# EAGLE schematic atmega_fusebit_doctor_V2_Custom_7_usb (EAGLE 7.6.0)
AUTHOR: PAWEL KISIELEWSKI (MANEKINEN); REV: 2.0
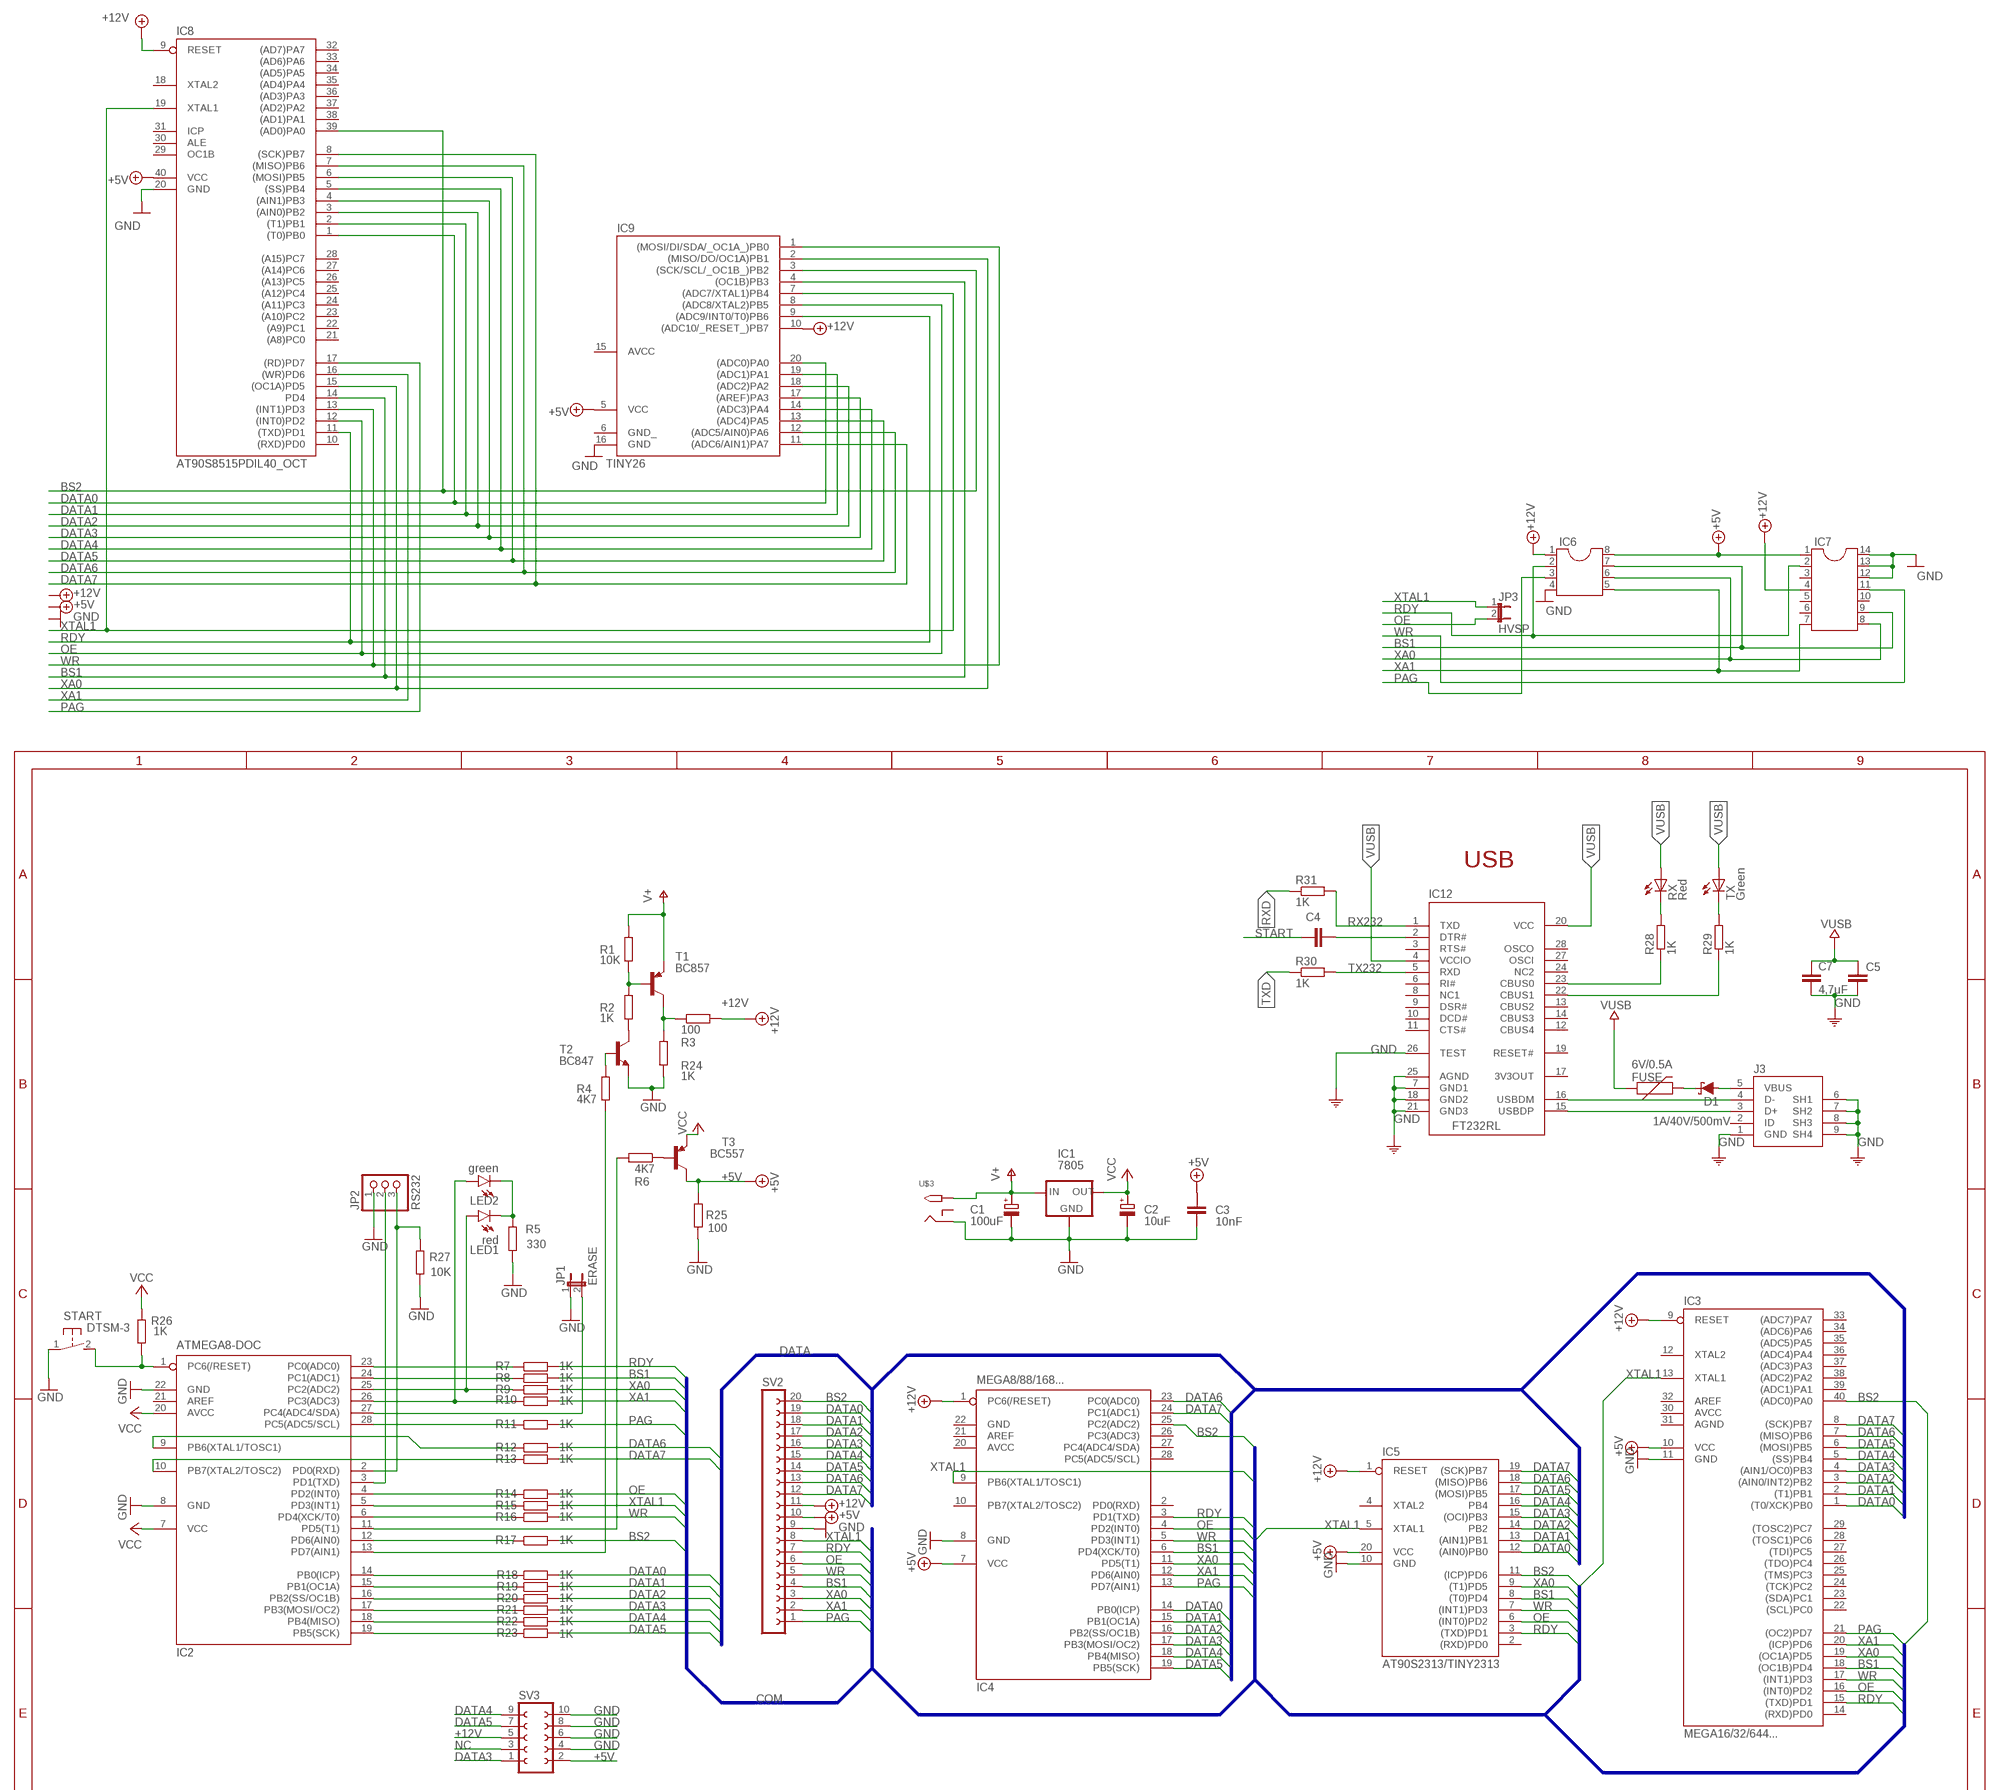
[diagram p0: schematic, sheet 1, part 1 of 3]
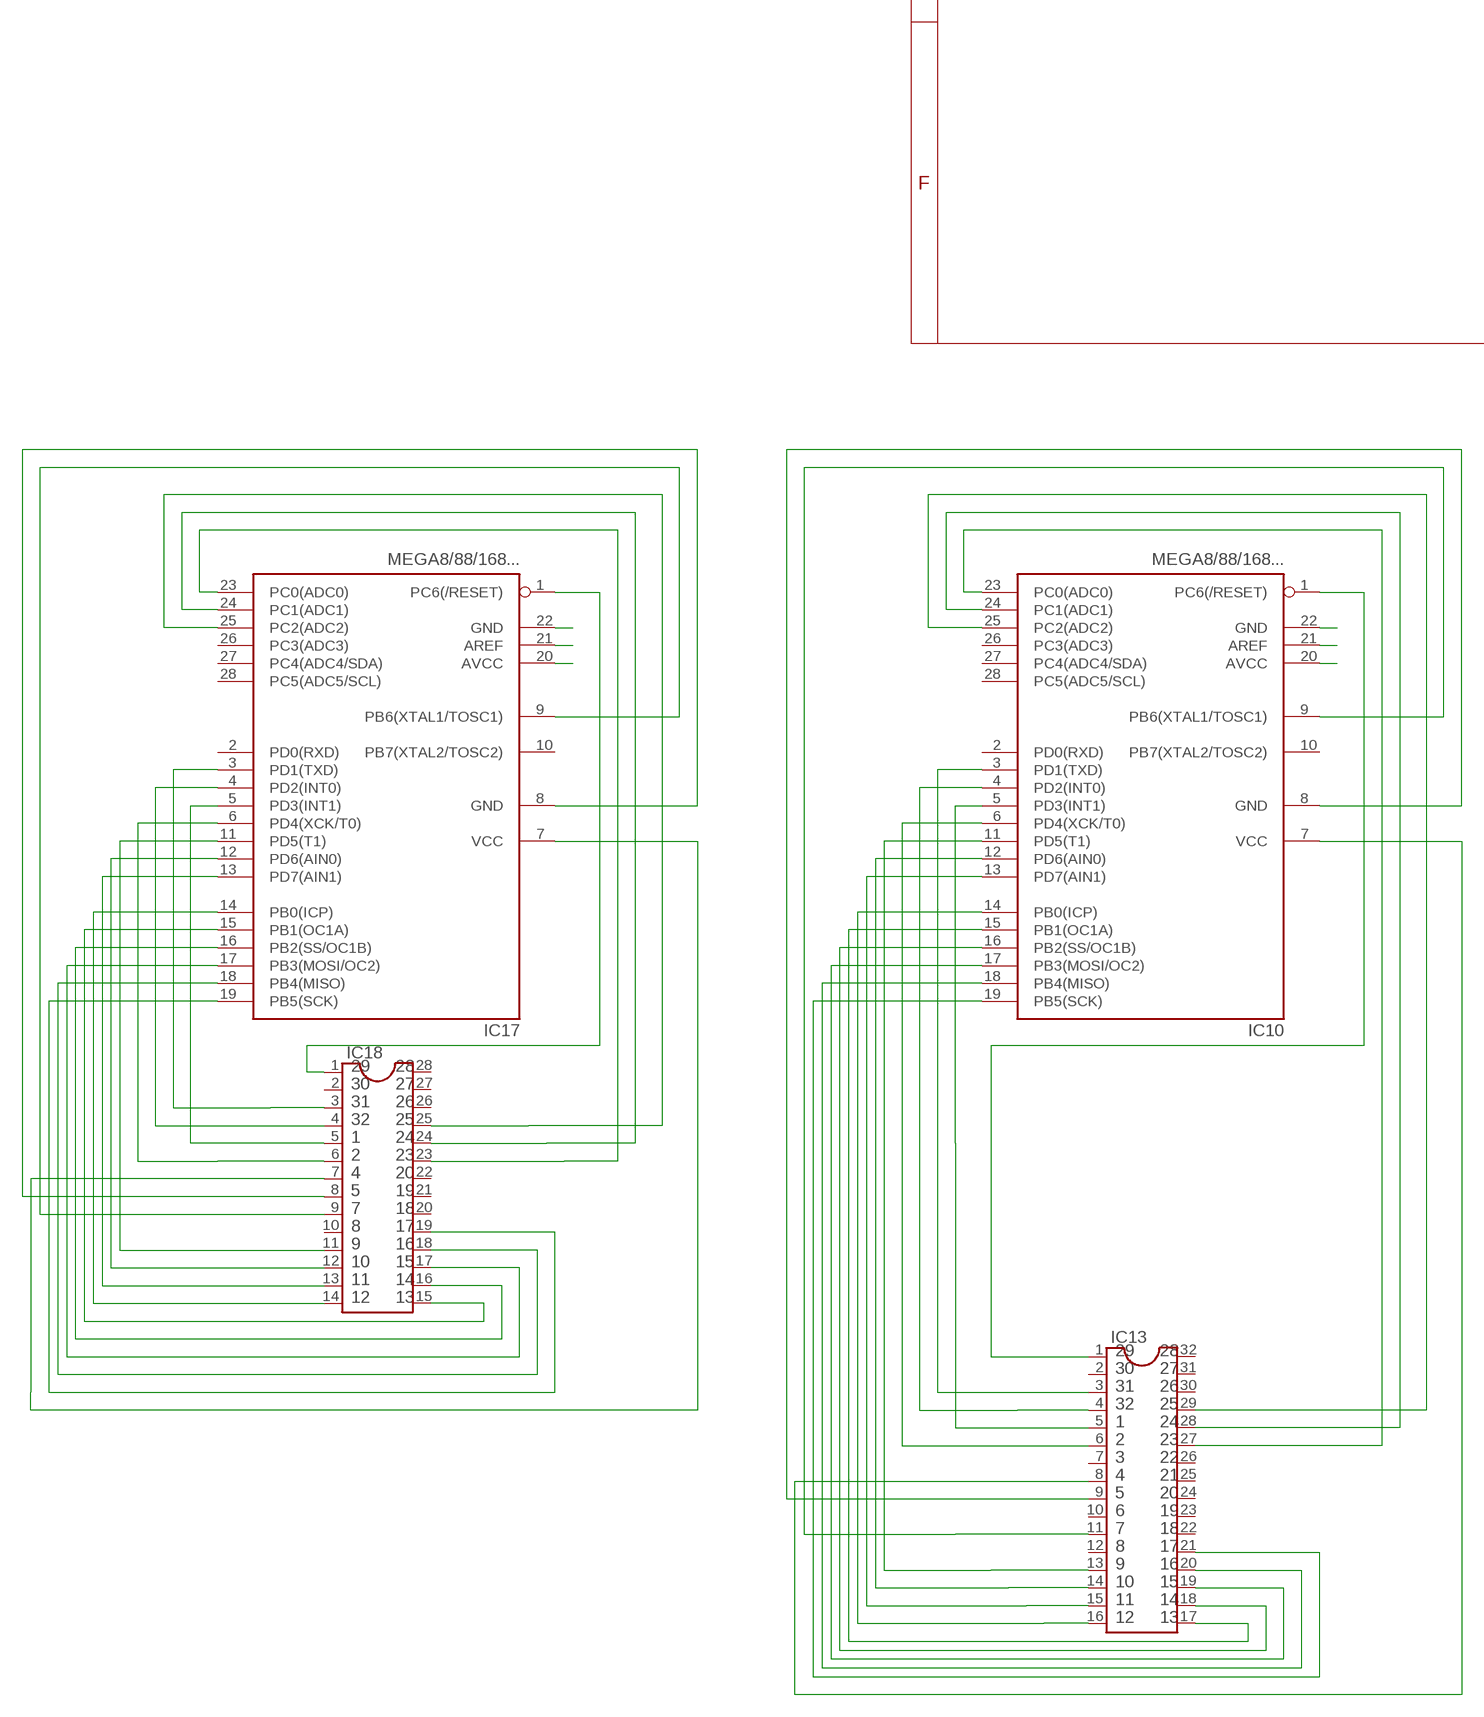
[diagram p1: schematic, sheet 1, part 2 of 3]
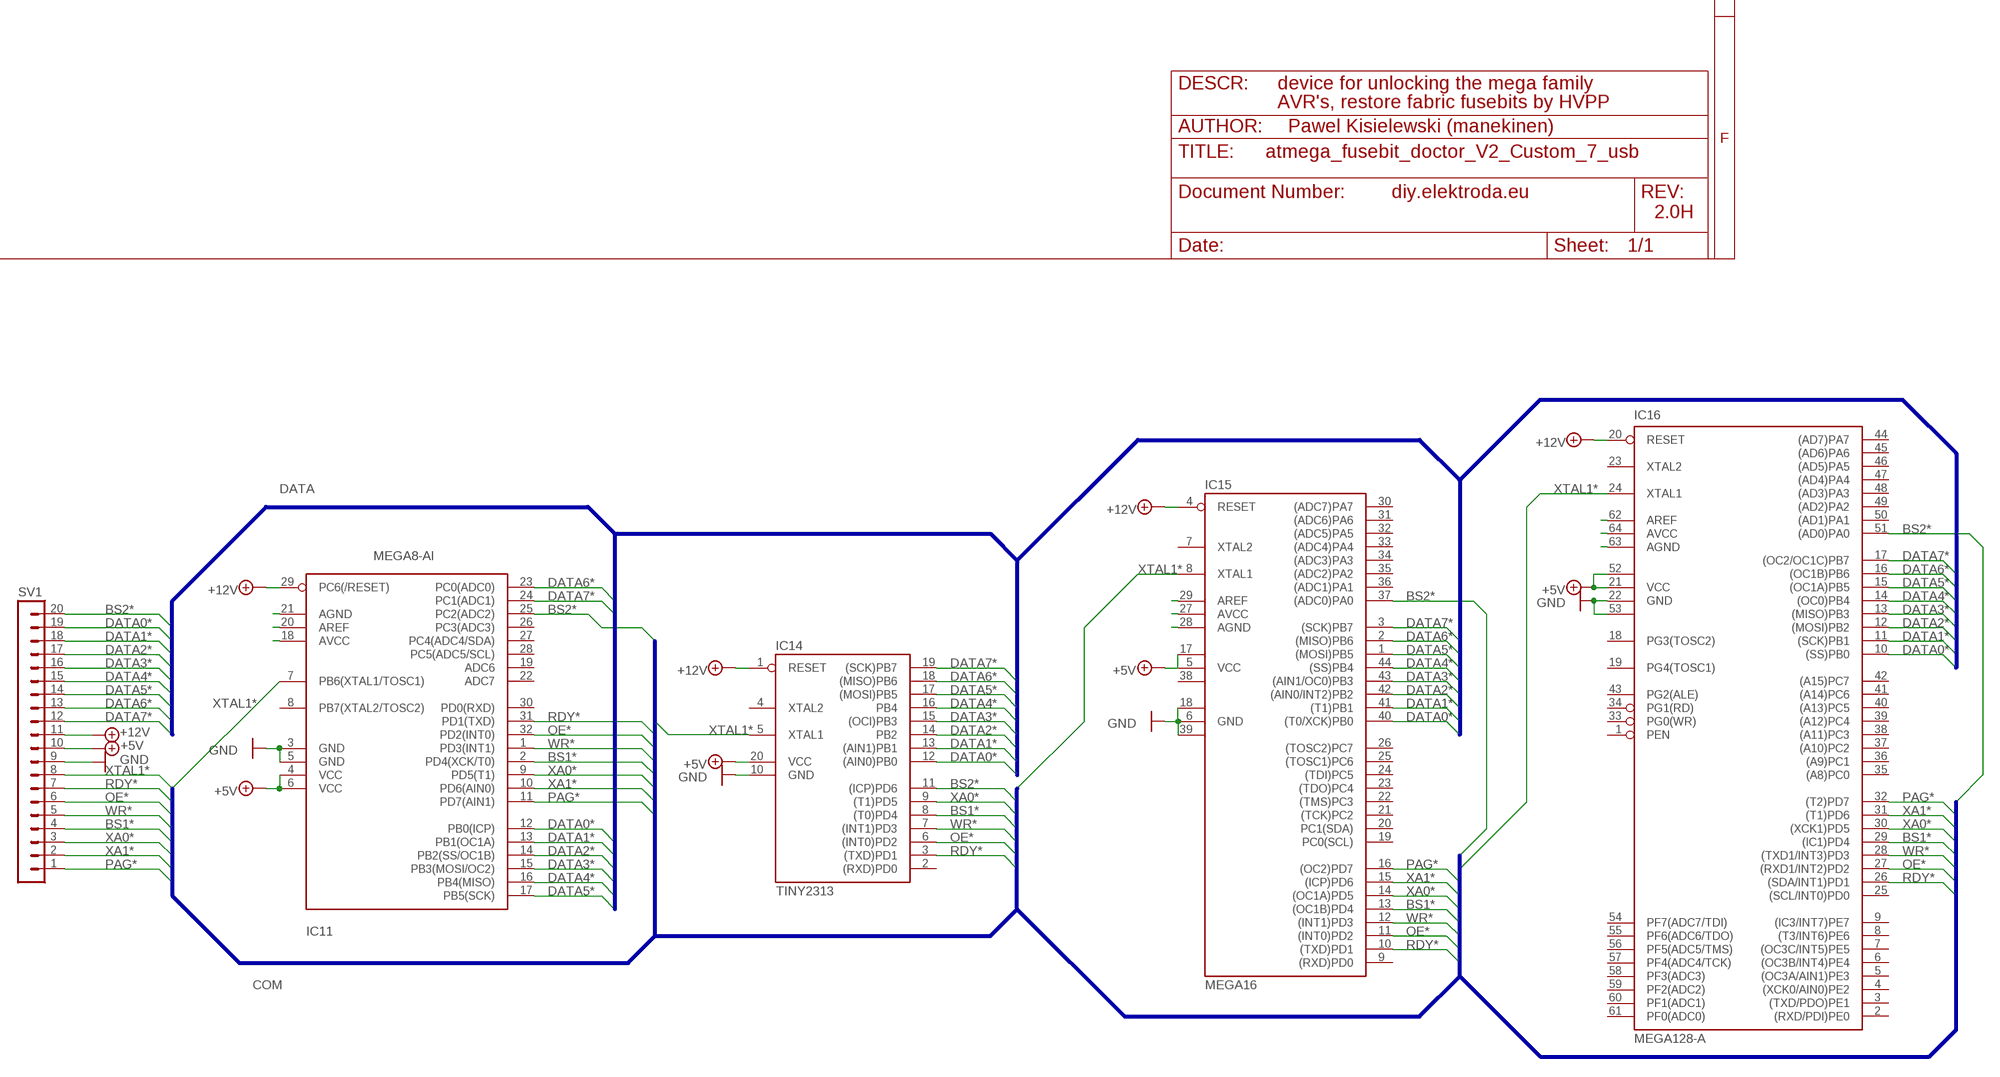
[diagram p2: schematic, sheet 1, part 3 of 3]

## Parts
C1  100uF  CPOL-EU153CLV-0605  [153CLV-0605]
C2  10uF  CPOL-EU153CLV-0405  [153CLV-0405]
C3  10nF  C-EUC0805  [C0805]
C4  100nF  C-EUC0805  [C0805]
C5  100nF  C-EUC0805  [C0805]
C7  4,7uF  C-EUC1206  [C1206]
D1  1A/40V/500mV  DIODE-SCHOTTKY-SS14  [SMA-DIODE]
FUSE  6V/0.5A  PPTC_HALF-AMP  [1206]
IC1  7805  78XXL  [78XXL]
IC2  ATMEGA8-DOC  MEGA8-P  [DIL28-3_OCT]
IC3  MEGA16/32/644...  MEGA16-P  [DIL40_OCT]
IC4  MEGA8/88/168...  MEGA8-P  [DIL28-3_OCT]
IC5  AT90S2313/TINY2313  AT90S2313P  [DIL20_OCT]
IC6  DIL8S  [SOCKED-08]
IC7  DIL14S  [SOCKED-14]
IC8  AT90S8515PDIL40_OCT  [DIL40_OCT]
IC9  TINY26  [DIL20_OCT]
IC10  MEGA8/88/168...  MEGA8-P  [DIL28-3_OCT]
IC11  MEGA8-AI  [TQFP32-08]
IC12  FT232RL  0226_FT232RL  [SSOP28]
IC13  DIL32  [DIL32]
IC14  TINY2313  AT90S2313S  [SO20L]
IC15  MEGA16  MEGA16-A  [TQFP44]
IC16  MEGA128-A  [TQFP64]
IC17  MEGA8/88/168...  MEGA8-P  [DIL28-3_OCT]
IC18  DIL28  [DIL28-6]
J3  0219_14850  [USB-MINI-B_2]
JP1  ERASE  JP1E  [JP1]
JP2  RS232  PINHD-1X3  [1X03]
JP3  HVSP  JP1E  [JP1]
LED1  red  LED1206  [LED-1206]
LED2  green  LED1206  [LED-1206]
R1  10K  R-EU_R0805  [R0805]
R2  1K  R-EU_R0805  [R0805]
R3  100  R-EU_R0805  [R0805]
R4  4K7  R-EU_R0805  [R0805]
R5  330  R-EU_R0805  [R0805]
R6  4K7  R-EU_R0805  [R0805]
R7  1K  R-EU_R0805  [R0805]
R8  1K  R-EU_R0805  [R0805]
R9  1K  R-EU_R0805  [R0805]
R10  1K  R-EU_R0805  [R0805]
R11  1K  R-EU_R0805  [R0805]
R12  1K  R-EU_R0805  [R0805]
R13  1K  R-EU_R0805  [R0805]
R14  1K  R-EU_R0805  [R0805]
R15  1K  R-EU_R0805  [R0805]
R16  1K  R-EU_R0805  [R0805]
R17  1K  R-EU_R0805  [R0805]
R18  1K  R-EU_R0805  [R0805]
R19  1K  R-EU_R0805  [R0805]
R20  1K  R-EU_R0805  [R0805]
R21  1K  R-EU_R0805  [R0805]
R22  1K  R-EU_R0805  [R0805]
R23  1K  R-EU_R0805  [R0805]
R24  1K  R-EU_R0805  [R0805]
R25  100  R-EU_R0805  [R0805]
R26  1K  R-EU_R0805  [R0805]
R27  10K  R-EU_R0805  [R0805]
R28  1K  R-EU_R0805  [R0805]
R29  1K  R-EU_R0805  [R0805]
R30  1K  R-EU_R0805  [R0805]
R31  1K  R-EU_R0805  [R0805]
RX  Red  0181_KTP-2012SURCK  [CHIPLED_0805]
START  DTSM-3  [DTSM-3]
SV1  MA20-1  [MA20-1]
SV2  FE20-1  [FE20]
SV3  FE05-2  [FE05-2]
T1  BC857  BC857ALT1SMD  [SOT23-BEC]
T2  BC847  [SOT23]
T3  BC557  BC857ALT1SMD  [SOT23-BEC]
TX  Green  0043_KPT-2012SGC  [CHIPLED_0805]
U$3  2.1MMJACKTHM  [PJ-102A]

## Nets
1: IC10.5(PD3(INT1)) IC13.5
2: IC10.6(PD4(XCK/T0)) IC13.6
3 [PWR]: IC17.1(PC6(/RESET)) IC18.1
4 [PWR]: IC10.7(VCC) IC13.8
5 [GND]: IC10.8(GND) IC13.9
7: IC10.9(PB6(XTAL1/TOSC1)) IC13.11
9: IC10.11(PD5(T1)) IC13.13
10: IC10.12(PD6(AIN0)) IC13.14
11: IC10.13(PD7(AIN1)) IC13.15
12: IC10.14(PB0(ICP)) IC13.16
13: IC10.15(PB1(OC1A)) IC13.17
14: IC10.16(PB2(SS/OC1B)) IC13.18
15: IC10.17(PB3(MOSI/OC2)) IC13.19
16: IC10.18(PB4(MISO)) IC13.20
17: IC10.19(PB5(SCK)) IC13.21
19: IC17.3(PD1(TXD)) IC18.3
20: IC17.4(PD2(INT0)) IC18.4
21: IC17.5(PD3(INT1)) IC18.5
22: IC17.6(PD4(XCK/T0)) IC18.6
23: IC10.23(PC0(ADC0)) IC13.27
24: IC10.24(PC1(ADC1)) IC13.28
25: IC10.25(PC2(ADC2)) IC13.29
29 [PWR]: IC10.1(PC6(/RESET)) IC13.1
31: IC10.3(PD1(TXD)) IC13.3
32: IC10.4(PD2(INT0)) IC13.4
33 [PWR]: IC17.7(VCC) IC18.7
34 [GND]: IC17.8(GND) IC18.8
35: IC17.9(PB6(XTAL1/TOSC1)) IC18.9
37: IC17.11(PD5(T1)) IC18.11
38: IC17.12(PD6(AIN0)) IC18.12
39: IC17.13(PD7(AIN1)) IC18.13
40: IC17.14(PB0(ICP)) IC18.14
41: IC17.15(PB1(OC1A)) IC18.15
42: IC17.16(PB2(SS/OC1B)) IC18.16
43: IC17.17(PB3(MOSI/OC2)) IC18.17
44: IC17.18(PB4(MISO)) IC18.18
45: IC17.19(PB5(SCK)) IC18.19
47: IC17.23(PC0(ADC0)) IC18.23
48: IC17.24(PC1(ADC1)) IC18.24
49: IC17.25(PC2(ADC2)) IC18.25
+5V [PWR]: C3.1 IC3.10(VCC) IC4.7(VCC) IC5.20(VCC) IC6.8 IC7.1 IC8.40(VCC) IC9.5(VCC) R25.2 SV2.10 SV3.2 T3.C
+5V* [PWR]: IC11.4(VCC) IC11.6(VCC) IC14.20(VCC) IC15.5(VCC) IC15.17(VCC1) IC16.21(VCC) IC16.52(VCC1) SV1.10 ; supply symbol labelled +5V
+12V [PWR]: IC3.9(RESET) IC4.1(PC6(/RESET)) IC5.1(RESET) IC6.1 IC7.4 IC8.9(RESET) IC9.10((ADC10/_RESET_)PB7) R3.2 SV2.11 SV3.5
+12V* [PWR]: IC11.29(PC6(/RESET)) IC14.1(RESET) IC15.4(RESET) IC16.20(RESET) SV1.11 ; supply symbol labelled +12V
BS1: IC3.18((OC1B)PD4) IC4.6(PD4(XCK/T0)) IC5.8((T0)PD4) IC6.7 IC7.9 IC8.14(PD4) IC9.4((OC1B)PB3) R8.2 SV2.4
BS1*: IC11.2(PD4(XCK/T0)) IC14.8((T0)PD4) IC15.13((OC1B)PD4) IC16.29((IC1)PD4) SV1.4
BS2: IC3.40((ADC0)PA0) IC4.25(PC2(ADC2)) IC5.11((ICP)PD6) IC8.39((AD0)PA0) IC9.3((SCK/SCL/_OC1B_)PB2) R17.2 SV2.20
BS2*: IC11.25(PC2(ADC2)) IC14.11((ICP)PD6) IC15.37((ADC0)PA0) IC16.51((AD0)PA0) SV1.20
DATA0: IC3.1((T0/XCK)PB0) IC4.14(PB0(ICP)) IC5.12((AIN0)PB0) IC8.1((T0)PB0) IC9.20((ADC0)PA0) R18.2 SV2.19
DATA0*: IC11.12(PB0(ICP)) IC14.12((AIN0)PB0) IC15.40((T0/XCK)PB0) IC16.10((SS)PB0) SV1.19
DATA1: IC3.2((T1)PB1) IC4.15(PB1(OC1A)) IC5.13((AIN1)PB1) IC8.2((T1)PB1) IC9.19((ADC1)PA1) R19.2 SV2.18
DATA1*: IC11.13(PB1(OC1A)) IC14.13((AIN1)PB1) IC15.41((T1)PB1) IC16.11((SCK)PB1) SV1.18
DATA2: IC3.3((AIN0/INT2)PB2) IC4.16(PB2(SS/OC1B)) IC5.14(PB2) IC8.3((AIN0)PB2) IC9.18((ADC2)PA2) R20.2 SV2.17
DATA2*: IC11.14(PB2(SS/OC1B)) IC14.14(PB2) IC15.42((AIN0/INT2)PB2) IC16.12((MOSI)PB2) SV1.17
DATA3: IC3.4((AIN1/OC0)PB3) IC4.17(PB3(MOSI/OC2)) IC5.15((OCI)PB3) IC8.4((AIN1)PB3) IC9.17((AREF)PA3) R21.2 SV2.16 SV3.1
DATA3*: IC11.15(PB3(MOSI/OC2)) IC14.15((OCI)PB3) IC15.43((AIN1/OC0)PB3) IC16.13((MISO)PB3) SV1.16
DATA4: IC3.5((SS)PB4) IC4.18(PB4(MISO)) IC5.16(PB4) IC8.5((SS)PB4) IC9.14((ADC3)PA4) R22.2 SV2.15 SV3.9
DATA4*: IC11.16(PB4(MISO)) IC14.16(PB4) IC15.44((SS)PB4) IC16.14((OC0)PB4) SV1.15
DATA5: IC3.6((MOSI)PB5) IC4.19(PB5(SCK)) IC5.17((MOSI)PB5) IC8.6((MOSI)PB5) IC9.13((ADC4)PA5) R23.2 SV2.14 SV3.7
DATA5*: IC11.17(PB5(SCK)) IC14.17((MOSI)PB5) IC15.1((MOSI)PB5) IC16.15((OC1A)PB5) SV1.14
DATA6: IC3.7((MISO)PB6) IC4.23(PC0(ADC0)) IC5.18((MISO)PB6) IC8.7((MISO)PB6) IC9.12((ADC5/AIN0)PA6) R12.2 SV2.13
DATA6*: IC11.23(PC0(ADC0)) IC14.18((MISO)PB6) IC15.2((MISO)PB6) IC16.16((OC1B)PB6) SV1.13
DATA7: IC3.8((SCK)PB7) IC4.24(PC1(ADC1)) IC5.19((SCK)PB7) IC8.8((SCK)PB7) IC9.11((ADC6/AIN1)PA7) R13.2 SV2.12
DATA7*: IC11.24(PC1(ADC1)) IC14.19((SCK)PB7) IC15.3((SCK)PB7) IC16.17((OC2/OC1C)PB7) SV1.12
GND [GND]: C1.- C2.- C3.2 C5.2 C7.2 IC1.GND IC2.8(GND) IC2.22(GND) IC3.11(GND) IC4.8(GND) IC5.10(GND) IC6.4 IC7.12 IC7.13 IC7.14 IC8.20(GND) IC9.16(GND) IC12.7(GND1) IC12.18(GND2) IC12.21(GND3) IC12.25(AGND) IC12.26(TEST) J3.1(GND) J3.6(SH1) J3.7(SH2) J3.8(SH3) J3.9(SH4) JP1.1 JP2.1 R5.1 R24.1 R25.1 R27.2 START.1 SV2.9 SV3.4 SV3.6 SV3.8 SV3.10 T2.2(E) U$3.RING ; supply symbol labelled COM
GND* [GND]: IC11.3(GND) IC11.5(GND) IC14.10(GND) IC15.6(GND) IC15.18(GND1) IC15.39(GND2) IC16.22(GND) IC16.53(GND1) SV1.9 ; supply symbol labelled GND
N$1: R6.1 T3.B
N$2: IC2.14(PB0(ICP)) R18.1
N$4: IC2.28(PC5(ADC5/SCL)) R11.1
N$5: IC2.6(PD4(XCK/T0)) R16.1
N$6: IC2.4(PD2(INT0)) R14.1
N$8: R2.2 T2.3(C)
N$9: IC2.9(PB6(XTAL1/TOSC1)) R12.1
N$10: IC2.10(PB7(XTAL2/TOSC2)) R13.1
N$11: IC2.13(PD7(AIN1)) R4.2
N$12: IC2.11(PD5(T1)) R6.2
N$13: IC11.21(AGND)
N$14: IC2.15(PB1(OC1A)) R19.1
N$15: IC11.20(AREF)
N$16: IC2.16(PB2(SS/OC1B)) R20.1
N$17: IC11.18(AVCC)
N$18: IC15.29(AREF)
N$19: IC2.5(PD3(INT1)) R15.1
N$20: IC15.27(AVCC)
N$21: IC2.23(PC0(ADC0)) R7.1
N$22: R3.1 R24.2 T1.C
N$23: IC10.21(AREF)
N$24: IC2.17(PB3(MOSI/OC2)) R21.1
N$25: IC2.18(PB4(MISO)) R22.1
N$26: IC2.19(PB5(SCK)) R23.1
N$27: IC2.12(PD6(AIN0)) R17.1
N$28: IC10.20(AVCC)
N$29: R4.1 T2.1(B)
N$30: IC10.22(GND)
N$31: IC2.27(PC4(ADC4/SDA)) JP1.2
N$32: LED1.C LED2.C R5.2
N$33: IC15.28(AGND)
N$34: R1.2 R2.1 T1.B
N$35: IC16.62(AREF)
N$36: IC16.64(AVCC)
N$37: IC16.63(AGND)
N$38: IC17.21(AREF)
N$39: IC17.20(AVCC)
N$40: IC17.22(GND)
N$41: C4.2 IC12.2(DTR#)
N$42: IC2.24(PC1(ADC1)) R8.1
N$44: IC12.15(USBDP) J3.3(D+)
N$45: IC12.16(USBDM) J3.4(D-)
N$46: IC12.23(CBUS0) R28.1
N$47: IC2.26(PC3(ADC3)) LED2.A R10.1
N$48: IC2.25(PC2(ADC2)) LED1.A R9.1
N$50: IC12.22(CBUS1) R29.1
N$51: R28.2 RX.C
N$52: R29.2 TX.C
NC: SV3.3
OE: IC3.16((INT0)PD2) IC4.4(PD2(INT0)) IC5.6((INT0)PD2) IC8.12((INT0)PD2) IC9.8((ADC8/XTAL2)PB5) JP3.2 R14.2 SV2.6
OE*: IC11.32(PD2(INT0)) IC14.6((INT0)PD2) IC15.11((INT0)PD2) IC16.27((RXD1/INT2)PD2) SV1.6
PAG: IC3.21((OC2)PD7) IC4.13(PD7(AIN1)) IC6.3 IC8.17((RD)PD7) R11.2 SV2.1
PAG*: IC11.11(PD7(AIN1)) IC15.16((OC2)PD7) IC16.32((T2)PD7) SV1.1
RDY: IC3.15((TXD)PD1) IC4.3(PD1(TXD)) IC5.3((TXD)PD1) IC6.2 IC7.2 IC8.11((TXD)PD1) IC9.9((ADC9/INT0/T0)PB6) R7.2 SV2.7
RDY*: IC11.31(PD1(TXD)) IC14.3((TXD)PD1) IC15.10((TXD)PD1) IC16.26((SDA/INT1)PD1) SV1.7
RX232: IC12.1(TXD) R31.2
RXD: IC2.2(PD0(RXD)) JP2.3 R27.1 R31.1
START: C4.1 IC2.1(PC6(/RESET)) R26.1 START.2
TX232: IC12.5(RXD) R30.2
TXD: IC2.3(PD1(TXD)) JP2.2 R30.1
V+ [PWR]: C1.+ IC1.IN R1.1 T1.E U$3.TIP
VCC [PWR]: C2.+ IC1.OUT IC2.7(VCC) IC2.20(AVCC) R26.2 T3.E
VUSB [PWR]: C5.1 C7.1 FUSE.1 IC12.4(VCCIO) IC12.20(VCC) RX.A TX.A
VUSB_PREFUSE [PWR]: D1.C FUSE.2
VUSB_RAW [PWR]: D1.A J3.5(VBUS)
WR: IC3.17((INT1)PD3) IC4.5(PD3(INT1)) IC5.7((INT1)PD3) IC7.11 IC8.13((INT1)PD3) IC9.1((MOSI/DI/SDA/_OC1A_)PB0) R16.2 SV2.5
WR*: IC11.1(PD3(INT1)) IC14.7((INT1)PD3) IC15.12((INT1)PD3) IC16.28((TXD1/INT3)PD3) SV1.5
XA0: IC3.19((OC1A)PD5) IC4.11(PD5(T1)) IC5.9((T1)PD5) IC6.6 IC7.8 IC8.15((OC1A)PD5) IC9.2((MISO/DO/OC1A)PB1) R9.2 SV2.3
XA0*: IC11.9(PD5(T1)) IC14.9((T1)PD5) IC15.14((OC1A)PD5) IC16.30((XCK1)PD5) SV1.3
XA1: IC3.20((ICP)PD6) IC4.12(PD6(AIN0)) IC6.5 IC7.7 IC8.16((WR)PD6) R10.2 SV2.2
XA1*: IC11.10(PD6(AIN0)) IC15.15((ICP)PD6) IC16.31((T1)PD6) SV1.2
XTAL1: IC3.13(XTAL1) IC4.9(PB6(XTAL1/TOSC1)) IC5.5(XTAL1) IC8.19(XTAL1) IC9.7((ADC7/XTAL1)PB4) JP3.1 R15.2 SV2.8
XTAL1*: IC11.7(PB6(XTAL1/TOSC1)) IC14.5(XTAL1) IC15.8(XTAL1) IC16.24(XTAL1) SV1.8
Unconnected: IC2.21(AREF) IC3.12(XTAL2) IC3.14((RXD)PD0) IC3.22((SCL)PC0) IC3.23((SDA)PC1) IC3.24((TCK)PC2) IC3.25((TMS)PC3) IC3.26((TDO)PC4) IC3.27((TDI)PC5) IC3.28((TOSC1)PC6) IC3.29((TOSC2)PC7) IC3.33((ADC7)PA7) IC3.34((ADC6)PA6) IC3.35((ADC5)PA5) IC3.36((ADC4)PA4) IC3.37((ADC3)PA3) IC3.38((ADC2)PA2) IC3.39((ADC1)PA1) IC4.2(PD0(RXD)) IC4.10(PB7(XTAL2/TOSC2)) IC4.21(AREF) IC4.26(PC3(ADC3)) IC4.27(PC4(ADC4/SDA)) IC4.28(PC5(ADC5/SCL)) IC5.2((RXD)PD0) IC5.4(XTAL2) IC7.3 IC7.5 IC7.6 IC7.10 IC8.10((RXD)PD0) IC8.18(XTAL2) IC8.21((A8)PC0) IC8.22((A9)PC1) IC8.23((A10)PC2) IC8.24((A11)PC3) IC8.25((A12)PC4) IC8.26((A13)PC5) IC8.27((A14)PC6) IC8.28((A15)PC7) IC8.29(OC1B) IC8.30(ALE) IC8.31(ICP) IC8.32((AD7)PA7) IC8.33((AD6)PA6) IC8.34((AD5)PA5) IC8.35((AD4)PA4) IC8.36((AD3)PA3) IC8.37((AD2)PA2) IC8.38((AD1)PA1) IC10.2(PD0(RXD)) IC10.10(PB7(XTAL2/TOSC2)) IC10.26(PC3(ADC3)) IC10.27(PC4(ADC4/SDA)) IC10.28(PC5(ADC5/SCL)) IC11.8(PB7(XTAL2/TOSC2)) IC11.19(ADC6) IC11.22(ADC7) IC11.26(PC3(ADC3)) IC11.27(PC4(ADC4/SDA)) IC11.28(PC5(ADC5/SCL)) IC11.30(PD0(RXD)) IC12.3(RTS#) IC12.6(RI#) IC12.8(NC1) IC12.9(DSR#) IC12.10(DCD#) IC12.11(CTS#) IC12.12(CBUS4) IC12.13(CBUS2) IC12.14(CBUS3) IC12.19(RESET#) IC12.24(NC2) IC12.27(OSCI) IC12.28(OSCO) IC13.2 IC13.7 IC13.10 IC13.12 IC13.22 IC13.23 IC13.24 IC13.25 IC13.26 IC13.30 IC13.31 IC13.32 IC14.2((RXD)PD0) IC14.4(XTAL2) IC15.7(XTAL2) IC15.9((RXD)PD0) IC15.19(PC0(SCL)) IC15.20(PC1(SDA)) IC15.21((TCK)PC2) IC15.22((TMS)PC3) IC15.23((TDO)PC4) IC15.24((TDI)PC5) IC15.25((TOSC1)PC6) IC15.26((TOSC2)PC7) IC15.30((ADC7)PA7) IC15.31((ADC6)PA6) IC15.32((ADC5)PA5) IC15.33((ADC4)PA4) IC15.34((ADC3)PA3) IC15.35((ADC2)PA2) IC15.36((ADC1)PA1) IC16.1(PEN) IC16.2((RXD/PDI)PE0) IC16.3((TXD/PDO)PE1) IC16.4((XCK0/AIN0)PE2) IC16.5((OC3A/AIN1)PE3) IC16.6((OC3B/INT4)PE4) IC16.7((OC3C/INT5)PE5) IC16.8((T3/INT6)PE6) IC16.9((IC3/INT7)PE7) IC16.18(PG3(TOSC2)) IC16.19(PG4(TOSC1)) IC16.23(XTAL2) IC16.25((SCL/INT0)PD0) IC16.33(PG0(WR)) IC16.34(PG1(RD)) IC16.35((A8)PC0) IC16.36((A9)PC1) IC16.37((A10)PC2) IC16.38((A11)PC3) IC16.39((A12)PC4) IC16.40((A13)PC5) IC16.41((A14)PC6) IC16.42((A15)PC7) IC16.43(PG2(ALE)) IC16.44((AD7)PA7) IC16.45((AD6)PA6) IC16.46((AD5)PA5) IC16.47((AD4)PA4) IC16.48((AD3)PA3) IC16.49((AD2)PA2) IC16.50((AD1)PA1) IC16.54(PF7(ADC7/TDI)) IC16.55(PF6(ADC6/TDO)) IC16.56(PF5(ADC5/TMS)) IC16.57(PF4(ADC4/TCK)) IC16.58(PF3(ADC3)) IC16.59(PF2(ADC2)) IC16.60(PF1(ADC1)) IC16.61(PF0(ADC0)) IC17.2(PD0(RXD)) IC17.10(PB7(XTAL2/TOSC2)) IC17.26(PC3(ADC3)) IC17.27(PC4(ADC4/SDA)) IC17.28(PC5(ADC5/SCL)) IC18.2 IC18.10 IC18.20 IC18.21 IC18.22 IC18.26 IC18.27 IC18.28 J3.2(ID) U$3.RING_SW

## Buses
DATA
COM

## Notes on the sheet
- USB
- DESCR: | device for unlocking the mega family
- AVR's, restore fabric fusebits by HVPP
- AUTHOR: | Pawel Kisielewski (manekinen)
- diy.elektroda.eu
- 2.0H
- 29 | 28
- 30 | 27
- 31 | 26
- 32 | 25
- 1 | 24
- 2 | 23
- 4 | 20
- 5 | 19
- 7 | 18
- 8 | 17
- 9 | 16
- 10 | 15
- 11 | 14
- 12 | 13
- 29 | 28
- 30 | 27
- 31 | 26
- 32 | 25
- 1 | 24
- 2 | 23
- 3 | 22
- 4 | 21
- 5 | 20
- 6 | 19
- 7 | 18
- 8 | 17
- 9 | 16
- 10 | 15
- 11 | 14
- 12 | 13

## Power pins joined to a net without a drawn wire
3V3OUT: IC12.17(3V3OUT)
AGND: IC3.31(AGND)
AREF: IC3.32(AREF)
AVCC: IC3.30(AVCC) IC4.20(AVCC) IC9.15(AVCC)
GND: IC4.22(GND)
GND_: IC9.6(GND_)
VCC2: IC15.38(VCC2)

## Library data of the parts
C1 C2 = resistor:CPOL-EU: POLARIZED CAPACITOR, European symbol
C3 = resistor:C-EU: CAPACITOR, European symbol
C4 C5 C7 = resistor@1:C-EU: CAPACITOR, European symbol
D1 = SparkFun-DiscreteSemi:DIODE-SCHOTTKY: Schottky diode A Schottky diode is a semiconductor diode which has a low forward voltage drop and a very fast switching action.; PROD_ID: DIO-08053
FUSE = SparkFun-Fuses:PPTC: Resettable Fuse PPTC Resettable Fuse. Really a sort of resistor with a polymeric positive temperature coefficient whose resistance increases dramatically with an increase in temperature. When heated by the power passing through the resistance rises causing the current to be limited, protecting the circuit. This is achieved by the transition of the polymer from a crystalline to an amorphous state where the conductive carbon separates breaking the conductive pathways found in the cool crystalline structure. When a PPTC cools back down it resumes conducting letting the circuit turn back on. SparkFun Products: SparkFun RedBoard - Programmed with Arduino <https://www.sparkfun.com/products/12757> Pro Micro - 5V/16MHz <https://www.sparkfun.com/products/12640> Arduino Pro 328 - 5V/16MHz <https://www.sparkfun.com/products/10915> MP3 Trigger <https://www.sparkfun.com/products/13720>; PROD_ID: RES-08585
IC1 = v-reg:78XXL: VOLTAGE REGULATOR
IC2 IC4 IC10 IC17 = atmega_fusebit_doctor_V2_Custom:MEGA8-P: MICROCONTROLLER 8 Kbytes FLASH, 1 kbytes SRAM, 512 bytes EEPROM, USART, 4-channel 10 bit ADC, 2-channel 8 bit ADC Pin compatible with Atmega48, ATMega88, ATMega168 Source: avr.lbr
IC3 = atmega_fusebit_doctor_V2_Custom:MEGA16-P: MICROCONTROLLER 16 Kbytes FLASH 1 kbytes SRAM 512 bytes EEPROM USART 8-channel 10 bit ADC
IC5 = atmega_fusebit_doctor_V2_Custom:AT90S2313: MICROCONTROLLER 2 Kbytes FLASH 128 bytes SRAM 128 bytes EEPROM UART
IC6 = ic-package:DIL8: Dual In Line
IC7 = ic-package:DIL14: Dual In Line
IC8 = atmega_fusebit_doctor_V2_Custom:AT90S8515P: MICROCONTROLLER 8 Kbytes FLASH 512 bytes SRAM 512 bytes EEPROM UART
IC9 = atmega_fusebit_doctor_V2_Custom:TINY26
IC11 = avr-6:MEGA8: MICROCONTROLLER 8 Kbytes FLASH 1 kbytes SRAM 512 bytes EEPROM USART 6-channel 10 bit ADC 2-channel 8 bit ADC
IC12 = IntegratedCircuits:0226_FT232RL: USB to serial UART interface -FT232RL; CASE: SSOP28; MONTHLY_USAGE: _____; PART_NUMBER: FT232RL; PRICE: _____; SUPPLIER: _____; TYPE: Circuito_Integrato
IC13 = atmega_fusebit_doctor_V2_Custom:DIL32: Dual In Line
IC14 = atmel:AT90S2313: MICROCONTROLLER 2 Kbytes FLASH 128 bytes SRAM 128 bytes EEPROM UART
IC15 = avr-6:MEGA16: MICROCONTROLLER 16 Kbytes FLASH 1 kbytes SRAM 512 bytes EEPROM USART 8-channel 10 bit ADC
IC16 = avr-6:MEGA128: MICROCONTROLLER 128 Kbytes FLASH 4 Kbytes SRAM 4 Kbytes EEPROM DUAL USART 8-channel 10 bit ADC
IC18 = atmega_fusebit_doctor_V2_Custom:DIL28: Dual In Line
J3 = Connettori:0219_14850: Usb-Mini F 90 Smd; MONTHLY_USAGE: _____; PART_NUMBER: 14850; PRICE: _____; SUPPLIER: _____; TYPE: Connettori; VALUE: USB-mini-90 -SMD
JP1 JP3 = jumper:JP1E: JUMPER
JP2 = pinhead:PINHD-1X3: PIN HEADER
LED1 LED2 = SparkFun-LED:LED: LED (Generic) Standard schematic elements and footprints for 5mm, 3mm, 1206, and 0603 sized LEDs. Generic LEDs with no color specified.
R1-R27 = resistor:R-EU_: RESISTOR, European symbol
R28-R31 = resistor@1:R-EU_: RESISTOR, European symbol
RX = Opto:0181_KTP-2012SURCK: LED RED - SMD - 0805; MONTHLY_USAGE: _____; PART_NUMBER: KTP-2012SURCK; PRICE: _____; SUPPLIER: _____; TYPE: Opto
START = mechanics:DTSM-3: Diptronics SMD button 6x3.5 mm
SV1 = con-lstb:MA20-1: PIN HEADER
SV2 = atmega_fusebit_doctor_V2_Custom:FE20-1: FEMALE HEADER; OC_FARNELL: unknown; OC_NEWARK: unknown
SV3 = con-lsta:FE05-2: FEMALE HEADER; OC_FARNELL: unknown; OC_NEWARK: unknown
T1 T3 = transistor-pnp:BC857*: PNP Transistror
T2 = transistor-neu-to92:BC847: NPN TRANSISTOR
TX = Opto:0043_KPT-2012SGC: LED GREEN - SMD-0805; MONTHLY_USAGE: _____; PART_NUMBER: KPT-2012SGC; PRICE: _____; SUPPLIER: _____; TYPE: Opto
U$3 = adafruit:2.1MMJACK: 2.1mm x 5.5mm THM DC jack with internal switch. Digikey part #PJ-102A, 4UCON part #05537 2.1mm x 5.5mm SMT DC jack with internal switch. Digikey part #PJ-002A-SMT, 4UCON part #03267 By microbuilder.eu & adafruit.com

## Net classes
0 default: width 0.305 mm
1 PWR: width 0.635 mm
2 GND: width 0.635 mm